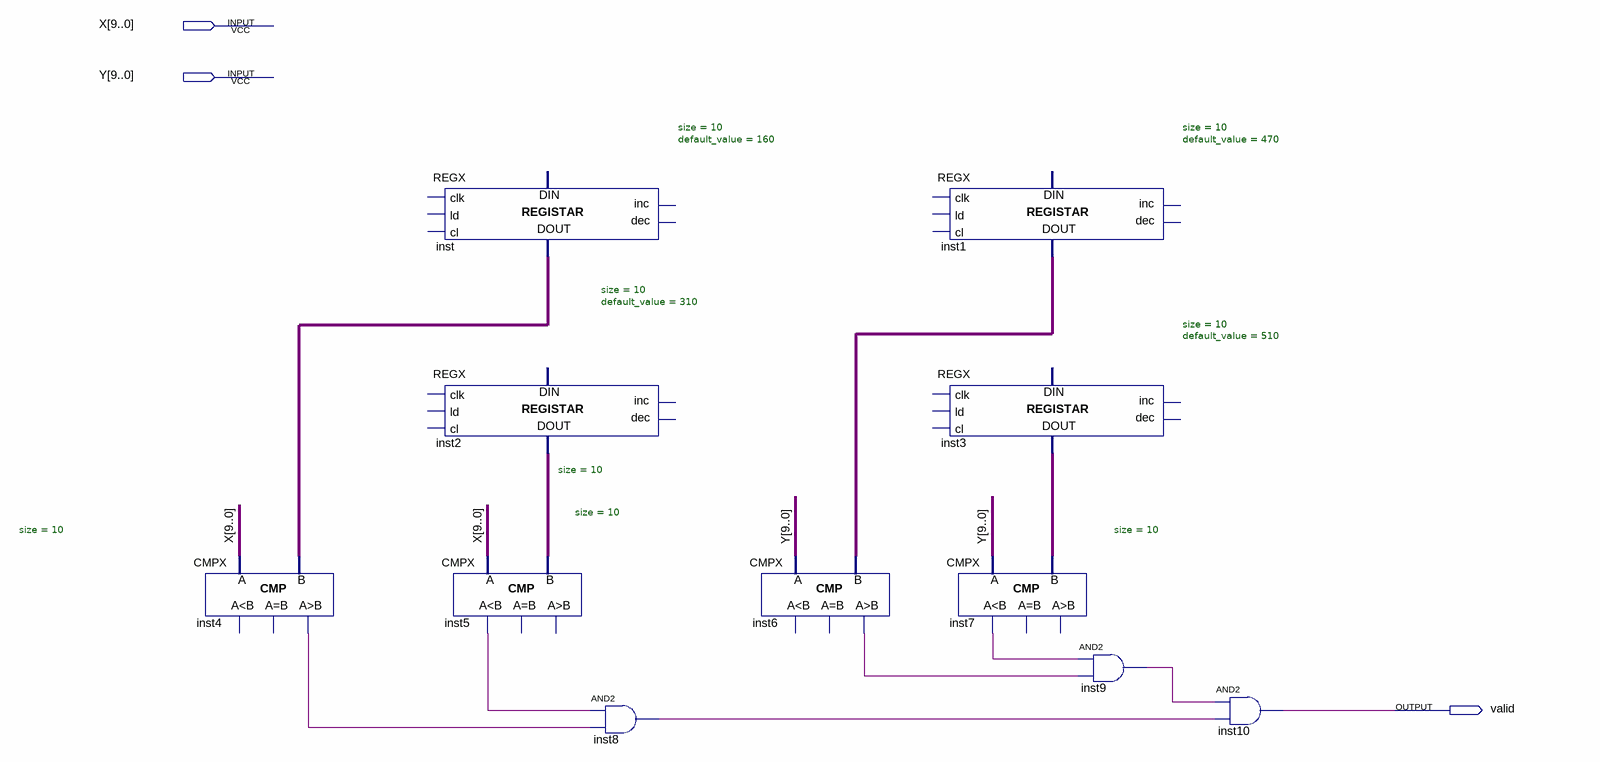
[diagram p0: schematic sheet]
// Quartus schematic dd.bdf as structural Verilog: 11 symbols, 3 pins
module dd (
  input  [9:0] X,
  input  [9:0] Y,
  output valid
);

  wire inst4_gr, inst5_ls, inst6_gr, inst7_ls, inst8_out, inst9_out;
  wire [9:0] inst1_data_out, inst2_data_out, inst3_data_out, inst_data_out;

  CMPX #(.size(10)) inst4 (.A(X), .B(inst_data_out), .gr(inst4_gr));  // open: ls, eq
  REGX #(.size(10), .default_value(160)) inst (.data_out(inst_data_out));  // open: clk, ld, cl, inc, dec, data_in
  REGX #(.size(10), .default_value(310)) inst2 (.data_out(inst2_data_out));  // open: clk, ld, cl, inc, dec, data_in
  CMPX #(.size(10)) inst5 (.A(X), .B(inst2_data_out), .ls(inst5_ls));  // open: eq, gr
  and inst8 (inst8_out, inst5_ls, inst4_gr);
  CMPX #(.size(10)) inst6 (.A(Y), .B(inst1_data_out), .gr(inst6_gr));  // open: ls, eq
  REGX #(.size(10), .default_value(470)) inst1 (.data_out(inst1_data_out));  // open: clk, ld, cl, inc, dec, data_in
  REGX #(.size(10), .default_value(510)) inst3 (.data_out(inst3_data_out));  // open: clk, ld, cl, inc, dec, data_in
  CMPX #(.size(10)) inst7 (.A(Y), .B(inst3_data_out), .ls(inst7_ls));  // open: eq, gr
  and inst9 (inst9_out, inst7_ls, inst6_gr);
  and inst10 (valid, inst9_out, inst8_out);
endmodule
